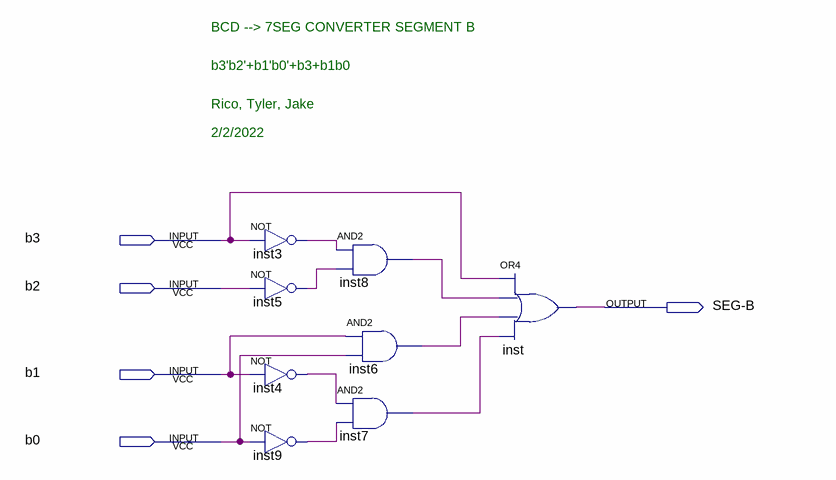
[diagram p0: schematic sheet]
// Quartus schematic BCD_7SEG_B.bdf as structural Verilog: 8 symbols, 5 pins
module BCD_7SEG_B (
  input  b3,
  input  b2,
  input  b1,
  input  b0,
  output \SEG-B 
);

  wire inst3_out, inst4_out, inst5_out, inst6_out, inst7_out, inst8_out, inst9_out;

  not inst3 (inst3_out, b3);
  not inst5 (inst5_out, b2);
  not inst4 (inst4_out, b1);
  not inst9 (inst9_out, b0);
  and inst8 (inst8_out, inst3_out, inst5_out);
  and inst6 (inst6_out, b1, b0);
  and inst7 (inst7_out, inst4_out, inst9_out);
  or inst (\SEG-B , b3, inst8_out, inst6_out, inst7_out);

  // Notes on the sheet:
  //   BCD --> 7SEG CONVERTER SEGMENT B
  //   b3'b2'+b1'b0'+b3+b1b0
  //   Rico, Tyler, Jake
  //   2/2/2022
endmodule
